# EAGLE design Warczok Wojciech 168937 (EAGLE 9.6.2)
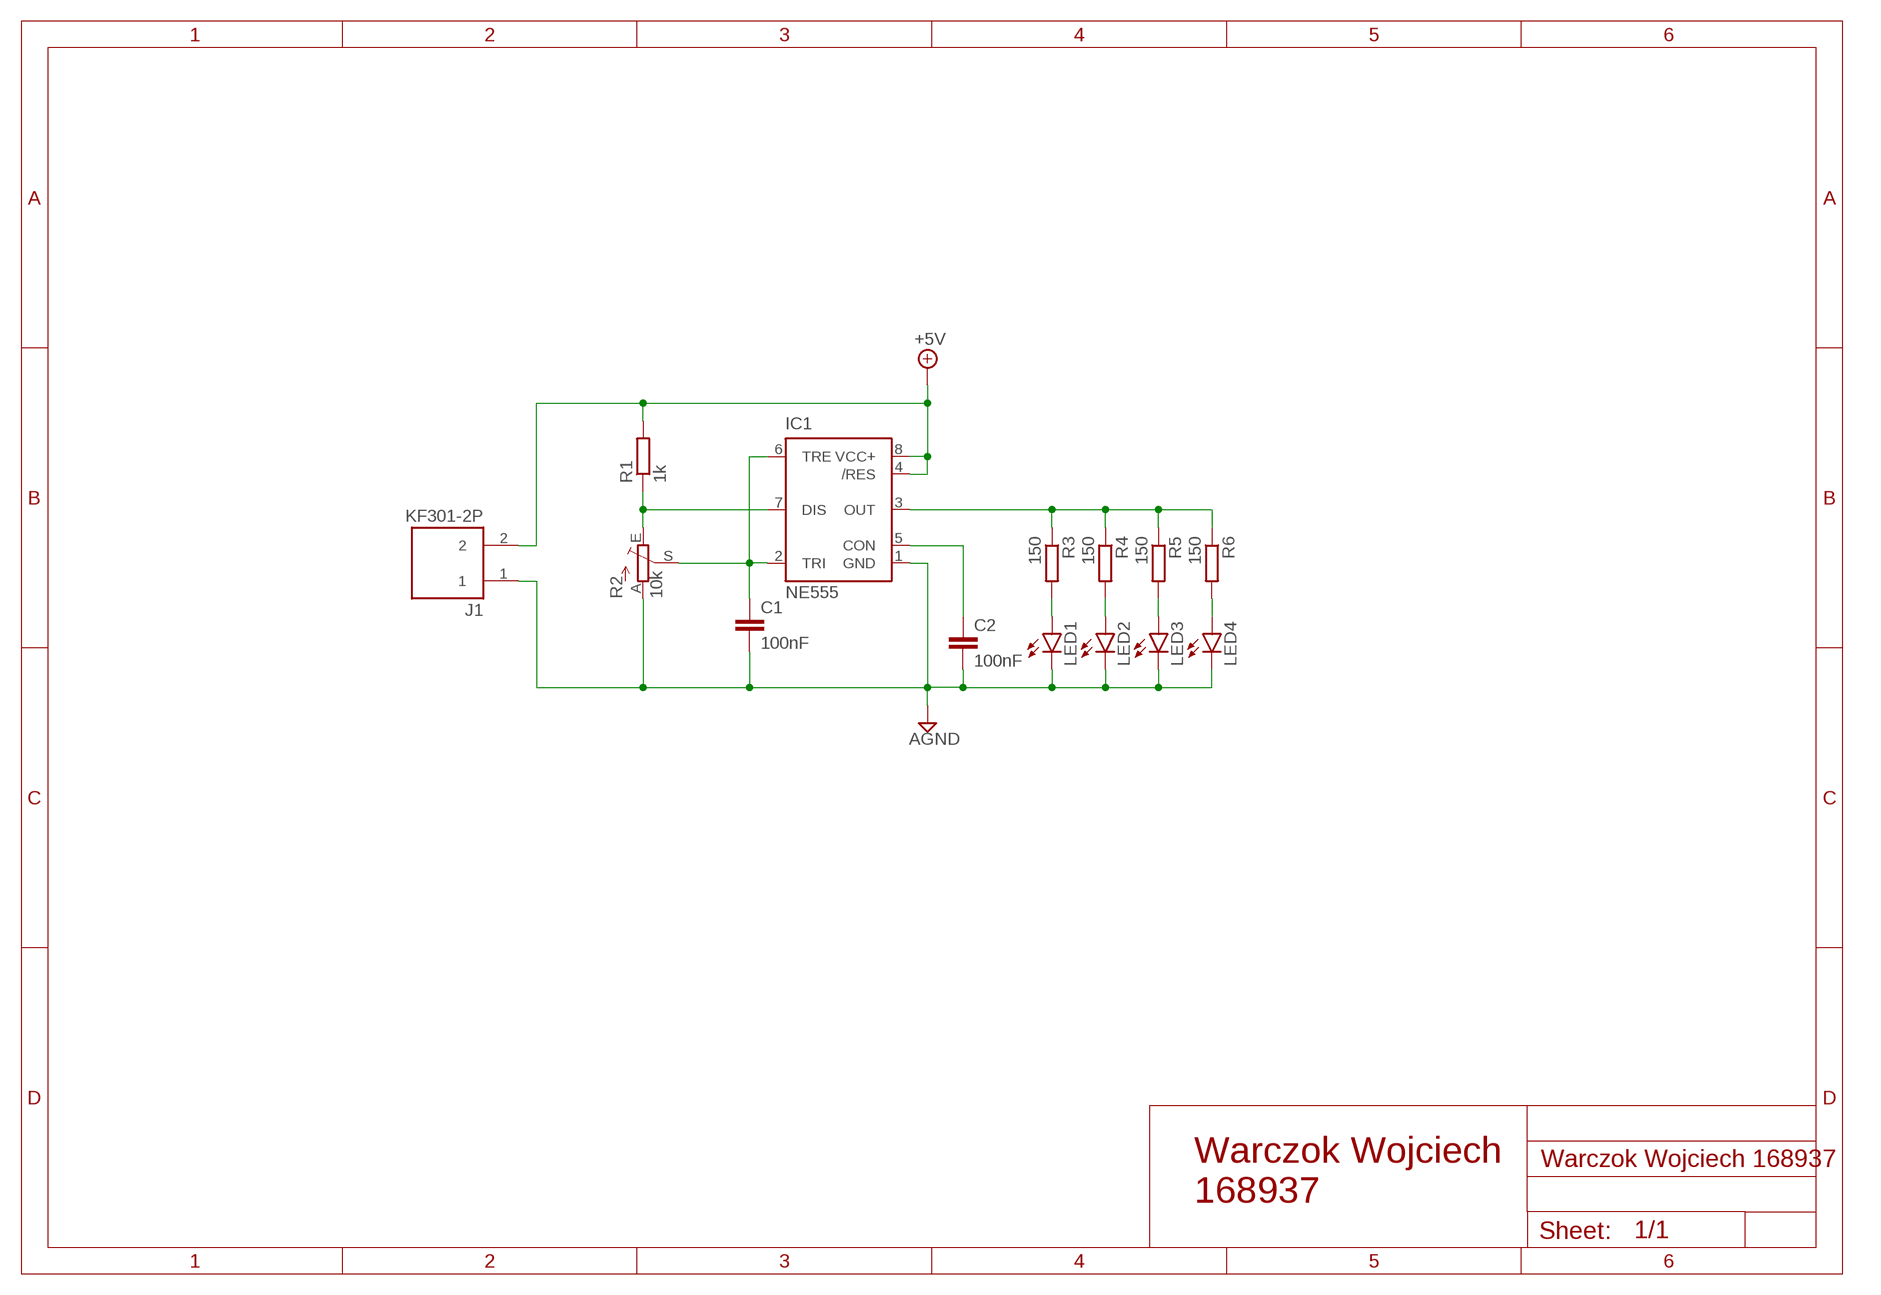
[diagram p0: schematic, sheet 1]

## Parts
C1  100nF  C-EU025-024X044  [C025-024X044]
C2  100nF  C-EU025-024X044  [C025-024X044]
IC1  NE555  [DIL-08]
J1  KF301-2P  [HANDSON_KF301-2P]
LED1  LED5MM  [LED5MM]
LED2  LED5MM  [LED5MM]
LED3  LED5MM  [LED5MM]
LED4  LED5MM  [LED5MM]
R1  1k  R-EU_0204/7  [0204/7]
R2  10k  TRIM_EU-CA6V  [CA6V]
R3  150  R-EU_0204/7  [0204/7]
R4  150  R-EU_0204/7  [0204/7]
R5  150  R-EU_0204/7  [0204/7]
R6  150  R-EU_0204/7  [0204/7]

## Nets
+5V: IC1.4(/RES) IC1.8(VCC+) J1.2 R1.2
AGND: C1.2 C2.2 IC1.1(GND) J1.1 LED1.K(C) LED2.K(C) LED3.K(C) LED4.K(C) R2.A
N$1: C1.1 IC1.2(TRI) IC1.6(TRE) R2.S
N$2: IC1.3(OUT) R3.1 R4.1 R5.1 R6.1
N$4: IC1.7(DIS) R1.1 R2.E
N$5: C2.1 IC1.5(CON)
N$7: LED1.A R3.2
N$8: LED2.A R4.2
N$9: LED3.A R5.2
N$10: LED4.A R6.2

## Notes on the sheet
- Warczok Wojciech
  168937

## Library data of the parts
C1 C2 = rcl:C-EU: CAPACITOR, European symbol; SPICEPREFIX: C
IC1 = st-microelectronics:NE555: General purpose bipolar Timer; MF: Arrow Electronics; MPN: NE555N; OC_FARNELL: 1467742; OC_NEWARK: 89K1486
J1 = KF301-2P:KF301-2P: 2 Pin Terminal Block 5mm Pitch Check prices <https://pricing.snapeda.com/parts/KF301-2P/Handson%20Technology/view-part?ref=eda>; AVAILABILITY: Not in stock; DESCRIPTION: 2 Pin Terminal Block 5mm Pitch; MF: Handson Technology; MP: KF301-2P; PACKAGE: Package; PRICE: None
LED1-LED4 = led:LED: LED OSRAM: - CHIPLED LG R971, LG N971, LY N971, LG Q971, LY Q971, LO R971, LY R971 LH N974, LH R974 LS Q976, LO Q976, LY Q976 LO Q996 - Hyper CHIPLED LW Q18S LB Q993, LB Q99A, LB R99A - SideLED LS A670, LO A670, LY A670, LG A670, LP A670 LB A673, LV A673, LT A673, LW A673 LH A674 LY A675 LS A676, LA A676, LO A676, LY A676, LW A676 LS A679, LY A679, LG A679 - Hyper Micro SIDELED® LS Y876, LA Y876, LO Y876, LY Y876 LT Y87S - SmartLED LW L88C, LW L88S LB L89C, LB L89S, LG L890 LS L89K, LO L89K, LY L89K LS L896, LA L896, LO L896, LY L896 - TOPLED LS T670, LO T670, LY T670, LG T670, LP T670 LSG T670, LSP T670, LSY T670, LOP T670, LYG T670 LG T671, LOG T671, LSG T671 LB T673, LV T673, LT T673, LW T673 LH T674 LS T676, LA T676, LO T676, LY T676, LB T676, LH T676, LSB T676, LW T676 LB T67C, LV T67C, LT T67C, LS T67K, LO T67K, LY T67K, LW E67C LS E67B, LA E67B, LO E67B, LY E67B, LB E67C, LV E67C, LT E67C LW T67C LS T679, LY T679, LG T679 LS T770, LO T770, LY T770, LG T770, LP T770 LB T773, LV T773, LT T773, LW T773 LH T774 LS E675, LA E675, LY E675, LS T675 LS T776, LA T776, LO T776, LY T776, LB T776 LHGB T686 LT T68C, LB T68C - Hyper Mini TOPLED® LB M676 - Mini TOPLED Santana® LG M470 LS M47K, LO M47K, LY M47K Source: http://www.osram.convergy.de LUXEON: - LUMILED® LXK2-PW12-R00, LXK2-PW12-S00, LXK2-PW14-U00, LXK2-PW14-V00 LXK2-PM12-R00, LXK2-PM12-S00, LXK2-PM14-U00 LXK2-PE12-Q00, LXK2-PE12-R00, LXK2-PE12-S00, LXK2-PE14-T00, LXK2-PE14-U00 LXK2-PB12-K00, LXK2-PB12-L00, LXK2-PB12-M00, LXK2-PB14-N00, LXK2-PB14-P00, LXK2-PB14-Q00 LXK2-PR12-L00, LXK2-PR12-M00, LXK2-PR14-Q00, LXK2-PR14-R00 LXK2-PD12-Q00, LXK2-PD12-R00, LXK2-PD12-S00 LXK2-PH12-R00, LXK2-PH12-S00 LXK2-PL12-P00, LXK2-PL12-Q00, LXK2-PL12-R00 Source: www.luxeon.com KINGBRIGHT: KA-3528ASYC Source: www.kingbright.com
R1 R3-R6 = rcl:R-EU_: RESISTOR, European symbol; SPICEPREFIX: R
R2 = pot:TRIM_EU-: POTENTIOMETER

## Board
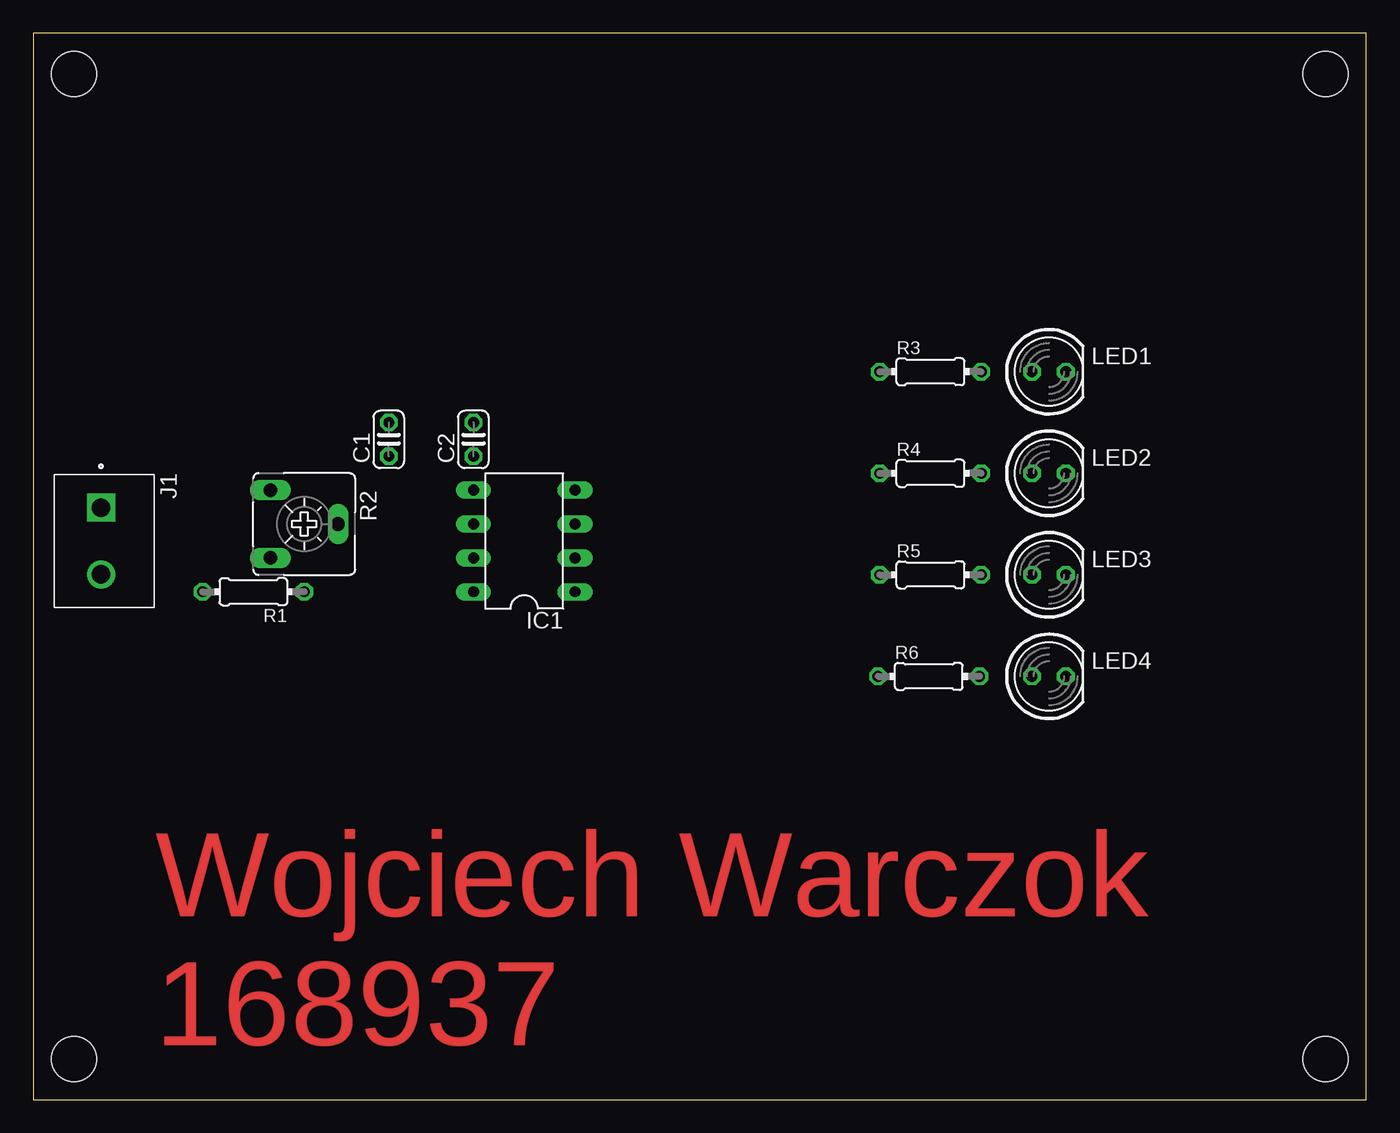
[diagram p1: board, top side]
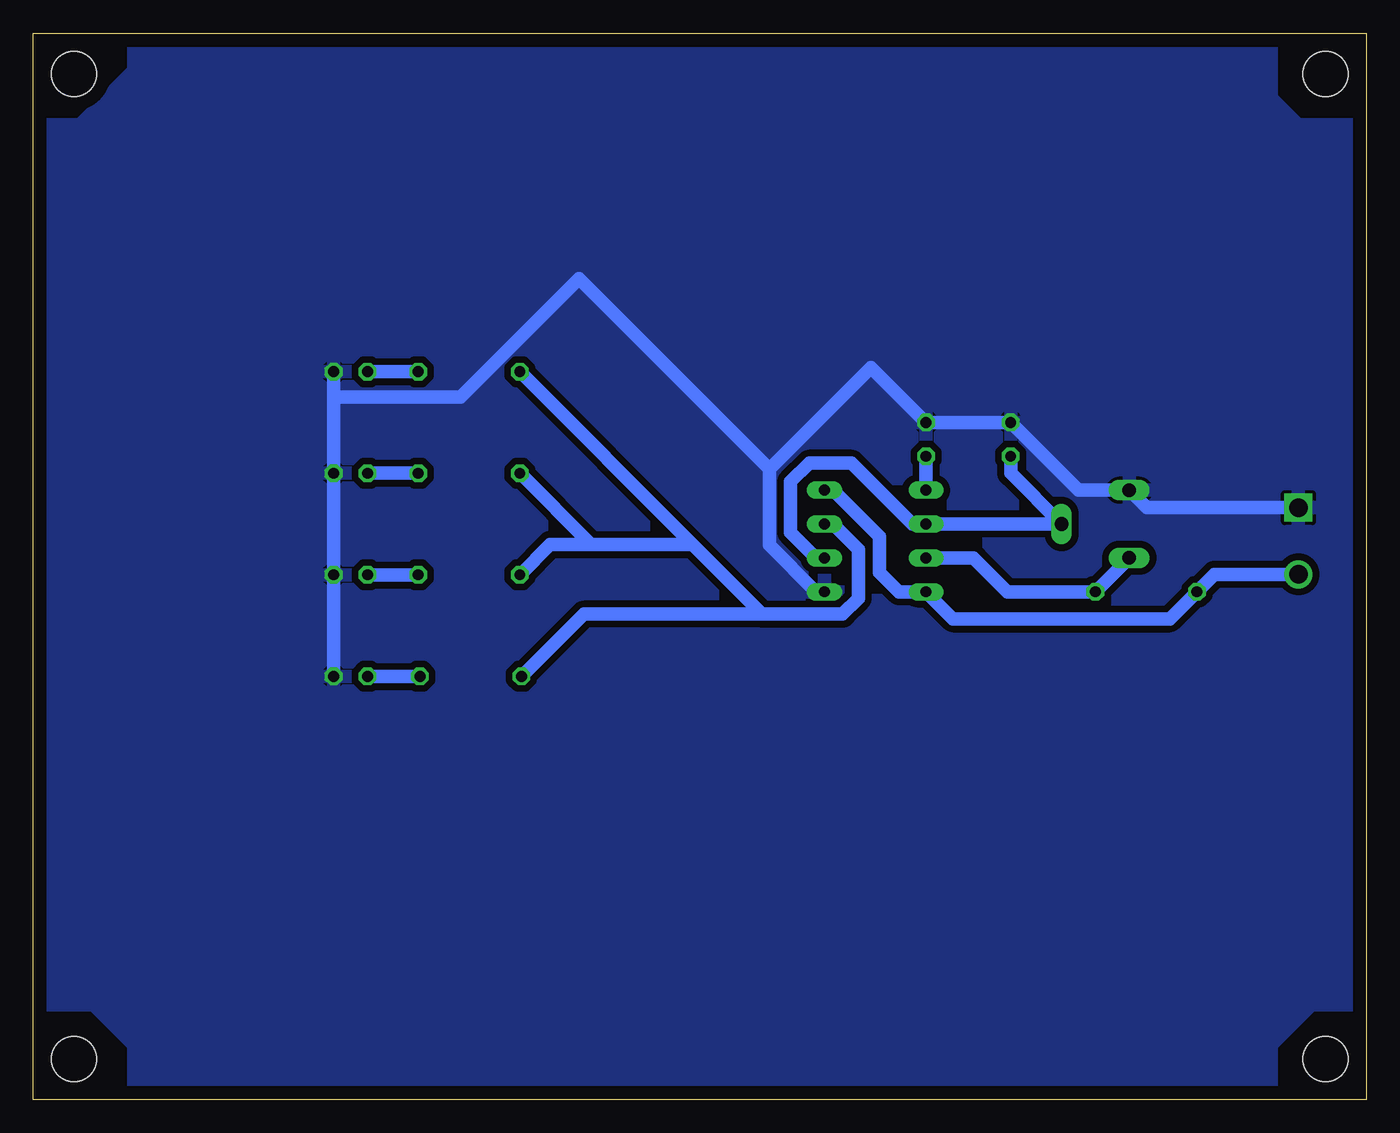
[diagram p2: board, bottom side, seen from below]

Size 100 x 80 mm. Coordinates in mm from the lower left corner, seen from the top.
Outline: 0,0 100,0 100,80 0,80 0,0
Copper layers (1*16): Top 0.035mm / dielectric 1.5mm / Bottom 0.035mm
Design rules "default *": minimum track width 40mil, minimum drill 0.35mm, track to track 20mil, track to pad 20mil, pad to pad 6mil, via to via 6mil, smd to smd 6mil, copper to edge 40mil, drill to drill 6mil, minimum pad ring 10mil, minimum via ring 8mil, stop-mask expansion 4mil, vias tented up to drill 0mil, thermal gap 10mil
Holes 3.4 mm at 3.05,76.96 3.05,3.05 96.95,3.05 96.95,76.95

### Footprints (pad centres in the part's own frame; a part is rotated, then mirrored left to right if it is on the bottom)
C025-024X044 = drill 0.813 octagon: 1 -1.27,0; 2 1.27,0
DIL-08 = drill 0.813 long: 1 -3.81,-3.81; 2 -1.27,-3.81; 3 1.27,-3.81; 4 3.81,-3.81; 5 3.81,3.81; 6 1.27,3.81; 7 -1.27,3.81; 8 -3.81,3.81
HANDSON_KF301-2P = drill 1.4 square: 1 -2.5,0 | drill 1.4: 2 2.5,0
LED5MM = drill 0.813 octagon: A -1.27,0; K 1.27,0
0204/7 = drill 0.813 octagon: 1 -3.81,0; 2 3.81,0
CA6V = drill 1.016 long: A -2.54,-2.54; E 2.54,-2.54; S 0,2.54

### Placement (x,y rotation side)
C1  26.67,49.53 90 top
C2  33.02,49.53 90 top
IC1  36.83,41.91 90 top
J1  5.08,41.91 270 top
LED1  76.2,54.61 0 top
LED2  76.2,46.99 0 top
LED3  76.2,39.37 0 top
LED4  76.2,31.75 0 top
R1  16.51,38.1 180 top
R2  20.32,43.18 270 top
R3  67.31,54.61 0 top
R4  67.31,46.99 0 top
R5  67.31,39.37 0 top
R6  67.18,31.75 0 top

### Tracks (layer width: path | path; a pad name or v marks a point on that pad's centre or on a via)
+5V
  Bottom 1.016: IC1.4 40.01,45.72 36.51,42.23 36.51,39.56 35.05,38.1 IC1.8 30.99,36.07 14.73,36.07 R1.2 11.39,39.41 J1.2
AGND
  Bottom 1.016: LED4.K LED3.K LED2.K 77.47,52.7 | 77.47,52.7 LED1.K | IC1.1 41.27,38.1 44.77,41.59 44.77,47.31 | 44.77,47.31 37.15,54.93 C2.2 C1.2 21.59,45.72 R2.A 16.47,44.41 J1.1 | 77.47,52.7 67.94,52.7 59.05,61.59 44.77,47.31
  pour Bottom: 0,73.15 5.08,73.15 7.11,75.18 7.11,80.26 92.46,80.26 92.46,77.22 95.5,74.17 96.52,73.15 100.58,73.15 100.58,7.11 95.5,7.11 92.46,4.06 92.46,0 7.11,0 7.11,4.06 4.06,7.11 0,7.11
N$1
  Bottom 1.016: C1.1 26.67,46.99 R2.S IC1.6 34.04,43.18 38.61,47.75 41.78,47.75 43.18,46.35 43.18,42.55 41.27,40.64 IC1.2
N$2
  Bottom 1.016: IC1.3 40.01,43.18 38.1,41.27 38.1,37.61 39.28,36.42 45.31,36.42 | R4.1 58.17,41.66 | R3.1 50.55,41.66 | R5.1 61.21,41.66 58.17,41.66 | 58.17,41.66 50.55,41.66 | 50.55,41.66 45.31,36.42 | 45.31,36.42 58.7,36.42 R6.1
N$4
  Bottom 1.016: R2.E R1.1 26.92,38.1 29.46,40.64 IC1.7
N$5
  Bottom 1.016: C2.1 IC1.5
N$7
  Bottom 1.016: LED1.A R3.2
N$8
  Bottom 1.016: LED2.A R4.2
N$9
  Bottom 1.016: LED3.A R5.2
N$10
  Bottom 1.016: LED4.A R6.2

### Text on the board
Top: Wojciech Warczok / 168937